# EAGLE schematic roboteagle_try2 (EAGLE 5.00)
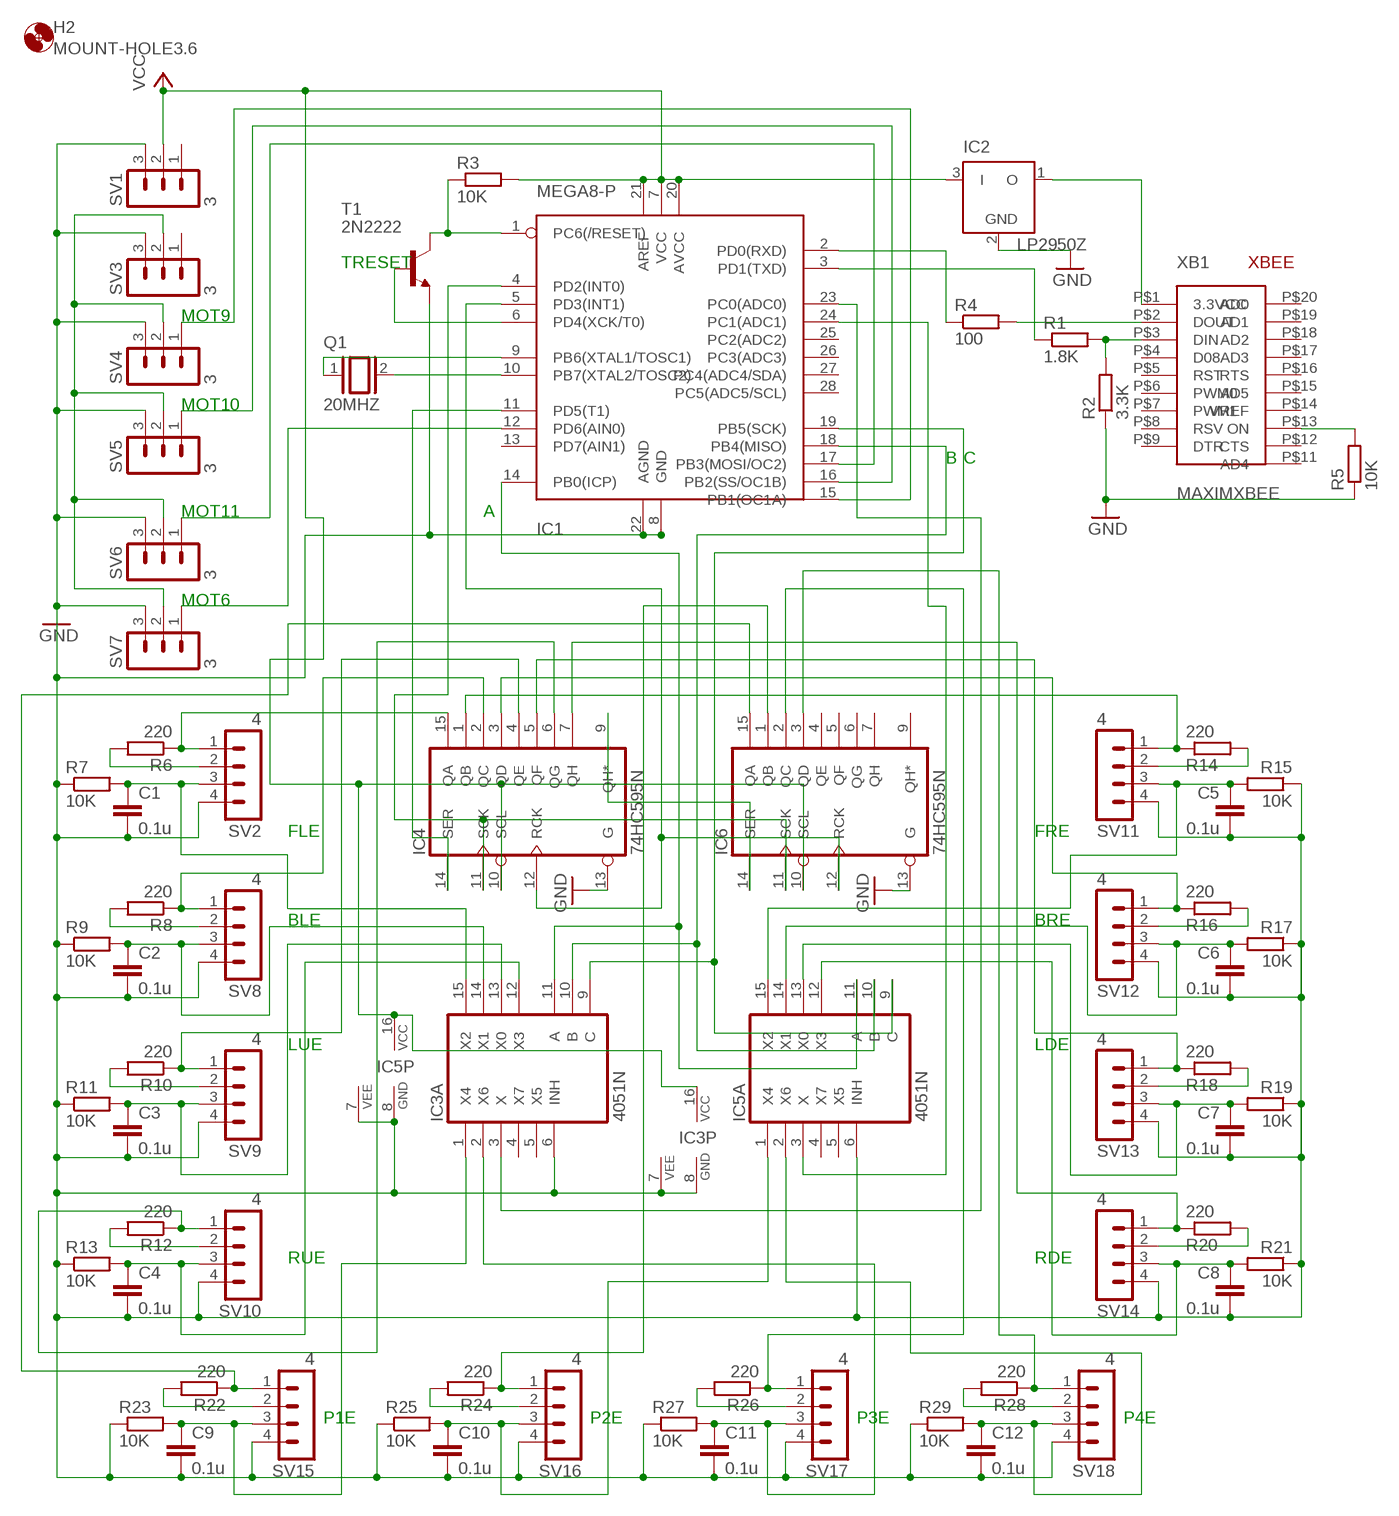
[diagram p0: schematic, sheet 1]

## Parts
C1  0.1u  C2.5/2  [C2.5-2]
C2  0.1u  C2.5/2  [C2.5-2]
C3  0.1u  C2.5/2  [C2.5-2]
C4  0.1u  C2.5/2  [C2.5-2]
C5  0.1u  C2.5/2  [C2.5-2]
C6  0.1u  C2.5/2  [C2.5-2]
C7  0.1u  C2.5/2  [C2.5-2]
C8  0.1u  C2.5/2  [C2.5-2]
C9  0.1u  C2.5/2  [C2.5-2]
C10  0.1u  C2.5/2  [C2.5-2]
C11  0.1u  C2.5/2  [C2.5-2]
C12  0.1u  C2.5/2  [C2.5-2]
H2  MOUNT-HOLE3.6  [3,6]
IC1  MEGA8-P  [DIL28-3]
IC2  LP2950Z  [TO92]
IC3  4051N  [DIL16]
IC4  74HC595N  [DIL16]
IC5  4051N  [DIL16]
IC6  74HC595N  [DIL16]
Q1  20MHZ  XTAL  [Q]
R1  1.8K  R-EU_0207/10  [0207/10]
R2  3.3K  R-EU_0207/10  [0207/10]
R3  10K  R-EU_0207/10  [0207/10]
R4  100  R-EU_0207/10  [0207/10]
R5  10K  R-EU_0207/10  [0207/10]
R6  220  R-EU_0207/10  [0207/10]
R7  10K  R-EU_0207/10  [0207/10]
R8  220  R-EU_0207/10  [0207/10]
R9  10K  R-EU_0207/10  [0207/10]
R10  220  R-EU_0207/10  [0207/10]
R11  10K  R-EU_0207/10  [0207/10]
R12  220  R-EU_0207/10  [0207/10]
R13  10K  R-EU_0207/10  [0207/10]
R14  220  R-EU_0207/10  [0207/10]
R15  10K  R-EU_0207/10  [0207/10]
R16  220  R-EU_0207/10  [0207/10]
R17  10K  R-EU_0207/10  [0207/10]
R18  220  R-EU_0207/10  [0207/10]
R19  10K  R-EU_0207/10  [0207/10]
R20  220  R-EU_0207/10  [0207/10]
R21  10K  R-EU_0207/10  [0207/10]
R22  220  R-EU_0207/10  [0207/10]
R23  10K  R-EU_0207/10  [0207/10]
R24  220  R-EU_0207/10  [0207/10]
R25  10K  R-EU_0207/10  [0207/10]
R26  220  R-EU_0207/10  [0207/10]
R27  10K  R-EU_0207/10  [0207/10]
R28  220  R-EU_0207/10  [0207/10]
R29  10K  R-EU_0207/10  [0207/10]
SV1  3  MA03-1  [MA03-1]
SV2  4  MA04-1  [MA04-1]
SV3  3  MA03-1  [MA03-1]
SV4  3  MA03-1  [MA03-1]
SV5  3  MA03-1  [MA03-1]
SV6  3  MA03-1  [MA03-1]
SV7  3  MA03-1  [MA03-1]
SV8  4  MA04-1  [MA04-1]
SV9  4  MA04-1  [MA04-1]
SV10  4  MA04-1  [MA04-1]
SV11  4  MA04-1  [MA04-1]
SV12  4  MA04-1  [MA04-1]
SV13  4  MA04-1  [MA04-1]
SV14  4  MA04-1  [MA04-1]
SV15  4  MA04-1  [MA04-1]
SV16  4  MA04-1  [MA04-1]
SV17  4  MA04-1  [MA04-1]
SV18  4  MA04-1  [MA04-1]
T1  2N2222  [TO18]
XB1  MAXIMXBEE  [DIL2051]

## Nets
3.3V: IC2.1(O) XB1.P$1(3.3VCC)
6V: SV3.2 SV4.2 SV5.2 SV6.2 SV7.2
A: IC1.14(PB0(ICP)) IC3.11(A:A) IC5.11(A:A)
A0: IC1.23(PC0(ADC0)) IC3.3(A:X)
A1: IC1.24(PC1(ADC1)) IC5.3(A:X)
B: IC1.18(PB4(MISO)) IC3.10(A:B) IC5.10(A:B)
BLA: R8.2 SV8.2
BLC: IC4.2(QC) R8.1 SV8.1
BLE: C2.1 IC3.14(A:X1) R9.2 SV8.3
BRE: C6.1 IC5.14(A:X1) R17.2 SV12.3
C: IC1.19(PB5(SCK)) IC3.9(A:C) IC5.9(A:C)
CLK: IC1.4(PD2(INT0)) IC4.11(SCK) IC6.11(SCK)
DATA: IC1.11(PD5(T1)) IC4.14(SER)
FLA: R6.2 SV2.2
FLC: IC4.15(QA) R6.1 SV2.1
FLE: C1.1 IC3.15(A:X2) R7.2 SV2.3
FRC: IC4.1(QB) R14.1 SV11.1
FRE: C5.1 IC5.15(A:X2) R15.2 SV11.3
GND: C1.2 C2.2 C3.2 C4.2 C5.2 C6.2 C7.2 C8.2 C9.2 C10.2 C11.2 C12.2 IC1.8(GND) IC1.22(AGND) IC2.2(GND) IC3.6(A:INH) IC3.7(P:VEE) IC3.8(P:GND) IC4.13(G) IC5.6(A:INH) IC5.7(P:VEE) IC5.8(P:GND) IC6.13(G) R2.1 R5.1 R7.1 R9.1 R11.1 R13.1 R15.1 R17.1 R19.1 R21.1 R23.1 R25.1 R27.1 R29.1 SV1.3 SV2.4 SV3.3 SV4.3 SV5.3 SV6.3 SV7.3 SV8.4 SV9.4 SV10.4 SV11.4 SV12.4 SV13.4 SV14.4 SV15.4 SV16.4 SV17.4 SV18.4 T1.1(E)
LATCH: IC1.5(PD3(INT1)) IC4.12(RCK) IC6.12(RCK)
LDA: R18.2 SV13.2
LDC: IC4.5(QF) R18.1 SV13.1
LDE: C7.1 IC5.13(A:X0) R19.2 SV13.3
LUA: R10.2 SV9.2
LUC: IC4.4(QE) R10.1 SV9.1
LUE: C3.1 IC3.13(A:X0) R11.2 SV9.3
MOT6: IC1.12(PD6(AIN0)) SV7.1
MOT9: IC1.15(PB1(OC1A)) SV4.1
MOT10: IC1.16(PB2(SS/OC1B)) SV5.1
MOT11: IC1.17(PB3(MOSI/OC2)) SV6.1
MRX: IC1.2(PD0(RXD)) R4.1
MTX: IC1.3(PD1(TXD)) R1.1
N$38: IC4.3(QD) R16.1 SV12.1
N$39: R16.2 SV12.2
N$71: R14.2 SV11.2
OSC1: IC1.9(PB6(XTAL1/TOSC1)) Q1.1
OSC2: IC1.10(PB7(XTAL2/TOSC2)) Q1.2
P1A: R22.2 SV15.2
P1C: IC6.15(QA) R22.1 SV15.1
P1E: C9.1 IC3.1(A:X4) R23.2 SV15.3
P2A: R24.2 SV16.2
P2C: IC6.1(QB) R24.1 SV16.1
P2E: C10.1 IC5.1(A:X4) R25.2 SV16.3
P3A: R26.2 SV17.2
P3C: IC6.2(QC) R26.1 SV17.1
P3E: C11.1 IC3.2(A:X6) R27.2 SV17.3
P4A: R28.2 SV18.2
P4C: IC6.3(QD) R28.1 SV18.1
P4E: C12.1 IC5.2(A:X6) R29.2 SV18.3
RDA: R20.2 SV14.2
RDC: IC4.7(QH) R20.1 SV14.1
RDE: C8.1 IC5.12(A:X3) R21.2 SV14.3
RST: IC1.1(PC6(/RESET)) R3.1 T1.3(C)
RUA: R12.2 SV10.2
RUC: IC4.6(QG) R12.1 SV10.1
RUE: C4.1 IC3.12(A:X3) R13.2 SV10.3
SEROUT: IC4.9(QH*) IC6.14(SER)
TRANSRST: IC1.6(PD4(XCK/T0)) T1.2(B)
VCC: IC1.7(VCC) IC1.20(AVCC) IC1.21(AREF) IC2.3(I) IC3.16(P:VCC) IC4.10(SCL) IC5.16(P:VCC) IC6.10(SCL) R3.2 SV1.2
XBDIN: R1.2 R2.2 XB1.P$3(DIN)
XBDOUT: R4.2 XB1.P$2(DOUT)
XBON: R5.2 XB1.P$13(ON)
Unconnected: IC1.13(PD7(AIN1)) IC1.25(PC2(ADC2)) IC1.26(PC3(ADC3)) IC1.27(PC4(ADC4/SDA)) IC1.28(PC5(ADC5/SCL)) IC3.4(A:X7) IC3.5(A:X5) IC5.4(A:X7) IC5.5(A:X5) IC6.4(QE) IC6.5(QF) IC6.6(QG) IC6.7(QH) IC6.9(QH*) SV1.1 SV3.1 XB1.P$4(D08) XB1.P$5(RST) XB1.P$6(PWM0) XB1.P$7(PWM1) XB1.P$8(RSV) XB1.P$9(DTR) XB1.P$11(AD4) XB1.P$12(CTS) XB1.P$14(VREF) XB1.P$15(AD5) XB1.P$16(RTS) XB1.P$17(AD3) XB1.P$18(AD2) XB1.P$19(AD1) XB1.P$20(AD0)

## Notes on the sheet
- TRESET
- MOT9
- MOT10
- B | C
- MOT11 | A
- MOT6
- FLE | FRE
- BLE | BRE
- LUE | LDE
- RUE | RDE
- P1E | P2E | P3E | P4E

## Power pins joined to a net without a drawn wire
GND: IC4.8(GND) IC6.8(GND) XB1.P$10(GND)
VCC: IC4.16(VCC) IC6.16(VCC)

## Library data of the parts
C1-C12 = capacitor-wima:C: CAPACITOR naming: grid - package width
H2 = holes:MOUNT-HOLE: MOUNTING HOLE with drill center marker
IC1 = atmel:MEGA8-P: MICROCONTROLLER 8 Kbytes FLASH, 1 kbytes SRAM, 512 bytes EEPROM, USART, 4-channel 10 bit ADC, 2-channel 8 bit ADC Pin compatible with Atmega48, ATMega88, ATMega168 Source: avr.lbr
IC2 = linear:LP2950: 100 mA, Low Power Low Dropout Voltage Regulator Source: http://www.onsemi.com/pub/Collateral/LP2950-D.PDF
IC3 IC5 = 40xx:4051: 8-channel ANALOG MULTIPLEXER
IC4 IC6 = 74xx-eu:74*595: 8-bit SHIFT REGISTER, output latch
Q1 = special:XTAL: CRYSTAL
R1-R29 = resistor:R-EU_: RESISTOR, European symbol
SV1 SV3-SV7 = con-lstb:MA03-1: PIN HEADER
SV2 SV8-SV18 = con-lstb:MA04-1: PIN HEADER
T1 = transistor:2N2222: NPN TRANSISTOR
XB1 = XBEE:MAXIMXBEE